# Altium project Peltier_ControllerV2.PrjPcb
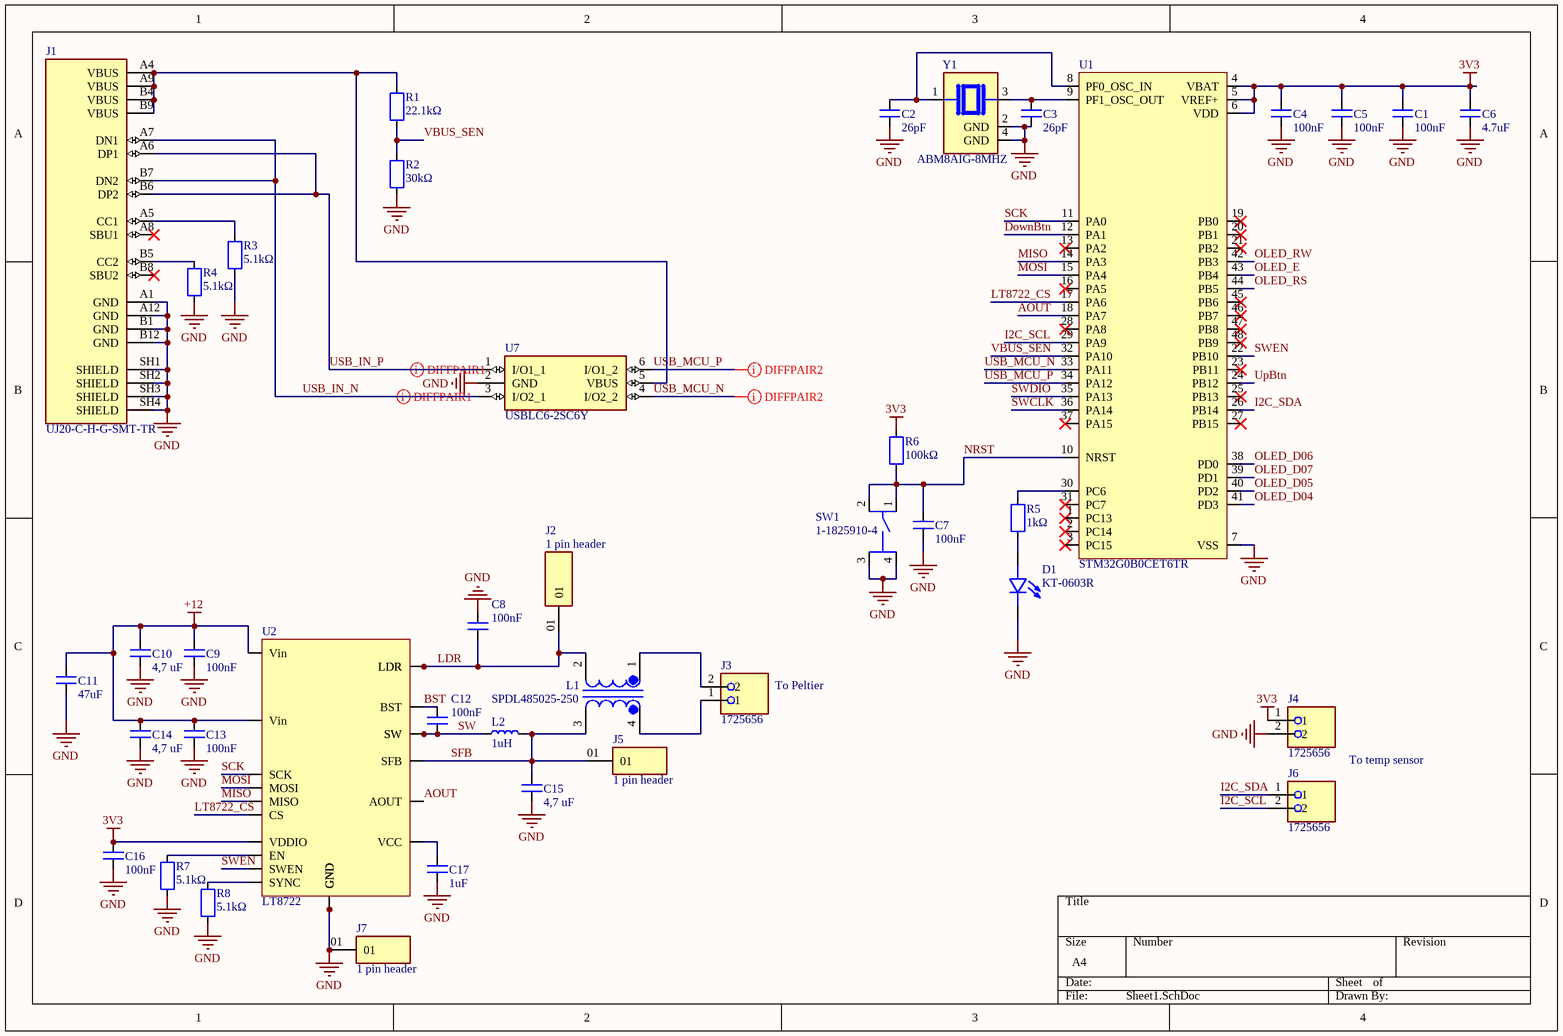
[diagram p0: Sheet1.SchDoc]
2 sheets, 76 parts. Net scope: global (net labels, ports and power ports of the same name join across sheets).
Board file: PCB1.PcbDoc
Sheets:
  Sheet1.SchDoc
  Sheet2.SchDoc

## Sheet Sheet1.SchDoc
size A4; SheetNumber: 1; SheetTotal: 2

### Parts
C1  100nF  [0603 Imperial]
C2  26pF  [0603 Imperial]
C3  26pF  [0603 Imperial]
C4  100nF  [0603 Imperial]
C5  100nF  [0603 Imperial]
C6  4.7uF  [0603 Imperial]
C7  100nF  [0603 Imperial]
C8  100nF  [0603 Imperial]
C9  100nF  [0603 Imperial]
C10  4,7 uF  [CAPC3216X180X55LL20T25]
C11  47uF  [FP-TAJD-MFG]
C12  100nF  [0603 Imperial]
C13  100nF  [0603 Imperial]
C14  4,7 uF  [CAPC3216X180X55LL20T25]
C15  4,7 uF  [CAPC3216X180X55LL20T25]
C16  100nF  [0603 Imperial]
C17  1uF  [0603 Imperial]
D1  KT-0603R  [LED_KT-0603R]
J1  UJ20-C-H-G-SMT-TR  [CUI_UJ20-C-H-G-SMT-TR]
J2  1 pin header  [SAMTEC_MTMM-101-X-X-S-X]
J3  1725656  [PHOENIX_1725656]
J4  1725656  [PHOENIX_1725656]
J5  1 pin header  [SAMTEC_MTMM-101-X-X-S-X]
J6  1725656  [PHOENIX_1725656]
J7  1 pin header  [SAMTEC_MTMM-101-X-X-S-X]
L1  SPDL485025-250  [IND_SPDL485025-250-2P-T]
L2  1uH  [1uH Power Inductor]
R1  22.1kΩ  [0603 Imperial]
R2  30kΩ  [0603 Imperial]
R3  5.1kΩ  [0603 Imperial]
R4  5.1kΩ  [0603 Imperial]
R5  1kΩ  [0603 Imperial]
R6  100kΩ  [0603 Imperial]
R7  5.1kΩ  [0603 Imperial]
R8  5.1kΩ  [0603 Imperial]
SW1  1-1825910-4  [TE_1-1825910-4]
U1  STM32G0B0CET6TR  [STM32G0B0CET6TR]
U2  LT8722  [LT8722]
U7  USBLC6-2SC6Y  [USB ESD protection]
Y1  ABM8AIG-8MHZ  [XTAL_ABM8AIG-8.000MHZ-8-V1R-T]

### Nets
3V3: C1.1 C4.1 C5.1 C6.1 C16.1 J4.1 R6.2 U1.4(VBAT) U1.5(VREF+) U1.6(VDD) U2.14(VDDIO)
+12: C9.1 C10.1 C11.2 C13.1 C14.1 U2.4(Vin) U2.11(Vin)
GND: C1.2 C2.2 C3.2 C4.2 C5.2 C6.2 C7.2 C8.1 C9.2 C10.2 C11.1 C13.2 C14.2 C15.2 C16.2 C17.2 D1.C J1.A1(GND) J1.A12(GND) J1.B1(GND) J1.B12(GND) J1.SH1(SHIELD) J1.SH2(SHIELD) J1.SH3(SHIELD) J1.SH4(SHIELD) J4.2 J7.01 R2.1 R3.1 R4.1 R7.1 R8.1 SW1.3 SW1.4 U1.7(VSS) U2.5(GND) U2.10(GND) U2.21(GND) U2.22(GND) U7.2(GND) Y1.2(GND) Y1.4(GND)
AOUT: U1.18(PA7) U2.20(AOUT)
BST: C12.1 U2.3(BST)
DownBtn: U1.12(PA1)
I2C_SCL: J6.2 U1.29(PA9)
I2C_SDA: J6.1 U1.26(PB14)
LDR: C8.2 J2.01 L1.2 U2.8(LDR) U2.9(LDR)
LT8722_CS: U1.17(PA6) U2.15(CS)
MISO: U1.14(PA3) U2.18(MISO)
MOSI: U1.15(PA4) U2.17(MOSI)
NRST: C7.1 R6.1 SW1.1 SW1.2 U1.10(NRST)
OLED_D04: U1.41(PD3)
OLED_D05: U1.40(PD2)
OLED_D06: U1.38(PD0)
OLED_D07: U1.39(PD1)
OLED_E: U1.43(PB4)
OLED_RS: U1.44(PB5)
OLED_RW: U1.42(PB3)
SCK: U1.11(PA0) U2.16(SCK)
SFB: C15.1 J5.01 L1.3 L2.2 U2.12(SFB)
SW: C12.2 L2.1 U2.6(SW) U2.7(SW)
SWCLK: U1.36(PA14)
SWDIO: U1.35(PA13)
SWEN: U1.22(PB10) U2.13(SWEN)
UpBtn: U1.24(PB12)
USB_IN_N: J1.A7(DN1) J1.B7(DN2) U7.3(I/O2_1)
USB_IN_P: J1.A6(DP1) J1.B6(DP2) U7.1(I/O1_1)
USB_MCU_N: U1.33(PA11) U7.4(I/O2_2)
USB_MCU_P: U1.34(PA12) U7.6(I/O1_2)
VBUS_SEN: R1.1 R2.2 U1.32(PA10)
NetC2_1: C2.1 U1.8(PF0_OSC_IN) Y1.1
NetC3_1: C3.1 U1.9(PF1_OSC_OUT) Y1.3
NetC17_1: C17.1 U2.2(VCC)
NetD1_A: D1.A R5.1
NetJ1_A4: J1.A4(VBUS) J1.A9(VBUS) J1.B4(VBUS) J1.B9(VBUS) R1.2 U7.5(VBUS)
NetJ1_A5: J1.A5(CC1) R3.2
NetJ1_B5: J1.B5(CC2) R4.2
NetJ3_1: J3.1 L1.4
NetJ3_2: J3.2 L1.1
NetR5_2: R5.2 U1.30(PC6)
NetR7_2: R7.2 U2.19(EN)
NetR8_2: R8.2 U2.1(SYNC)

Not connected (* = marked no-connect by the designer): J1 A8(SBU1)* B8(SBU2)*; U1 1(PC13)* 2(PC14)* 3(PC15)* 13(PA2)* 16(PA5)* 19(PB0)* 20(PB1)* 21(PB2)* 23(PB11)* 25(PB13)* 27(PB15)* 28(PA8)* 31(PC7)* 37(PA15)* 45(PB6)* 46(PB7)* 47(PB8)* 48(PB9)*

### Layout directives
differential pair: USB_IN_N, USB_IN_P, USB_MCU_N, USB_MCU_P

### Notes on the sheet
- (near J3) To Peltier
- To temp sensor
- Labels drawn without touching a wire or pin: \

### Library data of the parts
C1-C9 C12 C13 C16 C17 = 0603 C
C10 C14 C15 = 1206 Cap
C11 = Large Cap
D1 = KT-0603R: Red 0603 Light Emitting Diodes; MF: Hubei KENTO Elec; SnapEDA_Link: https://www.snapeda.com/parts/KT-0603R/Hubei+KENTO+Elec/view-part/?ref=snap; Package: Package; Value: *; MP: KT-0603R; Check_prices: https://www.snapeda.com/parts/KT-0603R/Hubei+KENTO+Elec/view-part/?ref=eda
J1 = UJ20-C-H-G-SMT-TR: Type C, USB 2.0, 480 Mbps, 20 Vdc, 5 A, Right Angle, Gold Flash, Surface Mount, Black Insulator, USB Receptacle; MF: Same Sky; SnapEDA_Link: https://www.snapeda.com/parts/UJ20-C-H-G-SMT-TR/Same+Sky/view-part/?ref=snap; Package: None; Value: *; MP: UJ20-C-H-G-SMT-TR; Check_prices: https://www.snapeda.com/parts/UJ20-C-H-G-SMT-TR/Same+Sky/view-part/?ref=eda
J2 J5 J7 = 1 pin header: Connector Header Through Hole 1 position; MF: Samtec; MP: MTMM-101-05-G-S-225; SnapEDA_Link: https://www.snapeda.com/parts/MTMM-101-05-G-S-225/Samtec/view-part/?ref=snap; Package: None; Value: *; Check_prices: https://www.snapeda.com/parts/MTMM-101-05-G-S-225/Samtec/view-part/?ref=eda
J3 J4 J6 = 1725656: PCB Terminal Screw 2.54mm 20AWG 160V 6A 2 Position COMBICON MPT Series | Phoenix Contact 1725656; SnapEDA_Link: https://www.snapeda.com/parts/1725656/Phoenix+Contact/view-part/?ref=snap; Package: None; Value: *; MF: Phoenix Contact; MP: 1725656; Check_prices: https://www.snapeda.com/parts/1725656/Phoenix+Contact/view-part/?ref=eda
L1 = SPDL485025-250-2P-T: Availability: Unavailable; Price: None; Value: *; MP: SPDL485025-250-2P-T; Package: None
L2 = 1uH Power Inductor
R1-R8 = 0603 R
SW1 = 1-1825910-4: Switch Tactile OFF _ON_ SPST Round Button PC Pins 0.05A 24VDC 100000Cycles 1.56N Thru-Hole; MF: TE Connectivity; Availability: Unavailable; SnapEDA_Link: https://www.snapeda.com/parts/1-1825910-4/TE%20Connectivity%20ALCOSWITCH%20Switches/view-part/558688/?ref=snap; Price: None; EU_RoHS_Compliance: Compliant; Package: None; TE_purchase_URL: https://www.te.com/usa-en/product-1-1825910-4.html?te_bu=Cor&te_type=disp&te_campaign=seda_glo_cor-seda-global-disp-prtnr-fy19-seda-model-bom-cta_sma-317_1&elqCampaignId=32493; MP: 1-1825910-4; Value: *
U7 = USB ESD protection: 17V Clamp 5A (8/20µs) Ipp Tvs Diode Surface Mount SOT-23-6; MF: STMicroelectronics; SnapEDA_Link: https://www.snapeda.com/parts/USBLC6-2SC6Y/STMicroelectronics/view-part/?ref=snap; Package: SOT-23-6 STMicroelectronics; Value: *; MP: USBLC6-2SC6Y; Check_prices: https://www.snapeda.com/parts/USBLC6-2SC6Y/STMicroelectronics/view-part/?ref=eda
Y1 = ABM8AIG-8.000MHZ-8-V1R-T: 8 MHz Â±10ppm Crystal 8pF 500 Ohms 4-SMD, No Lead; MF: Abracon LLC; Check_prices: https://www.snapeda.com/parts/ABM8AIG-8.000MHZ-8-V1R-T/Abracon+LLC/view-part/?ref=eda; Price: None; SnapEDA_Link: https://www.snapeda.com/parts/ABM8AIG-8.000MHZ-8-V1R-T/Abracon+LLC/view-part/?ref=snap; MP: ABM8AIG-8.000MHZ-8-V1R-T; Value: *; Availability: In Stock; Package: SMD-4 Abracon LLC; Purchase-URL: https://pricing.snapeda.com/search/part/ABM8AIG-8.000MHZ-8-V1R-T/?ref=eda

## Sheet Sheet2.SchDoc
size A4; SheetNumber: 2; SheetTotal: 2
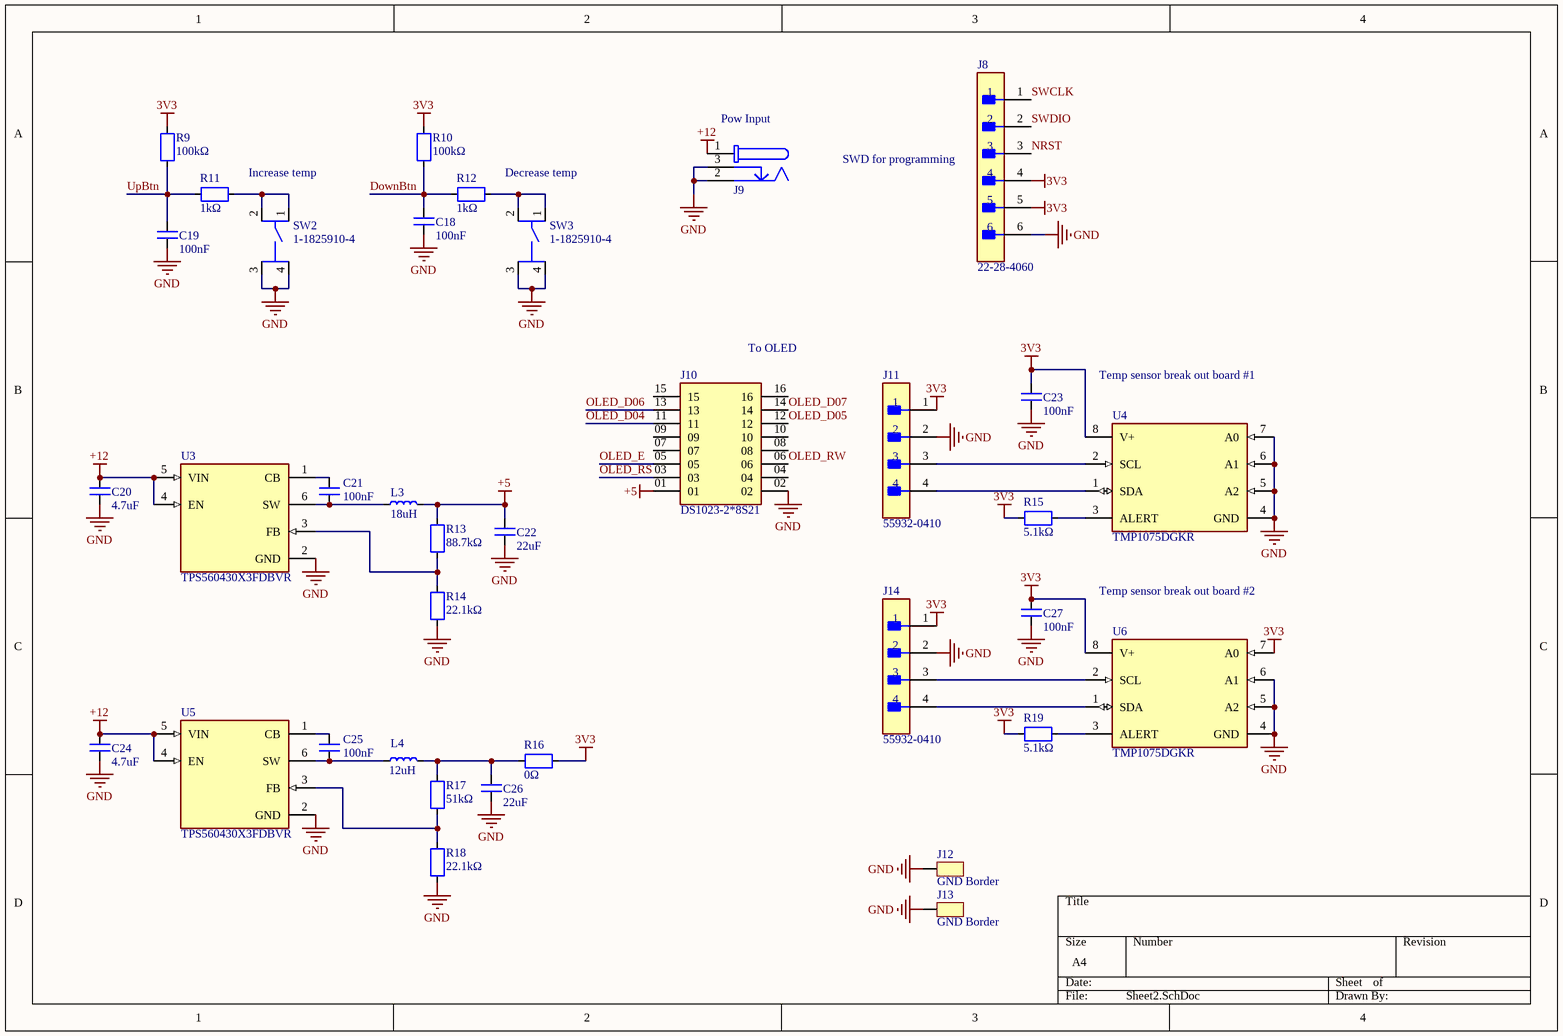
[diagram p1: Sheet2.SchDoc]

### Parts
C18  100nF  [0603 Imperial]
C19  100nF  [0603 Imperial]
C20  4.7uF  [0603 Imperial]
C21  100nF  [0603 Imperial]
C22  22uF  [0603 Imperial]
C23  100nF  [0603 Imperial]
C24  4.7uF  [0603 Imperial]
C25  100nF  [0603 Imperial]
C26  22uF  [0603 Imperial]
C27  100nF  [0603 Imperial]
J8  22-28-4060  [FP-22-28-4060-MFG]
J9  694106105102  [694108105102]  (value not drawn)
J10  DS1023-2*8S21  [16 pin header]
J11  55932-0410  [Wire Solder Pads]
J12  GND Border  [GND Border]
J13  GND Border  [GND Border]
J14  55932-0410  [Wire Solder Pads]
L3  18uH  [IND_SRR6038-180Y]
L4  12uH  [WE-PD2SR_7850]
R9  100kΩ  [0603 Imperial]
R10  100kΩ  [0603 Imperial]
R11  1kΩ  [0603 Imperial]
R12  1kΩ  [0603 Imperial]
R13  88.7kΩ  [0603 Imperial]
R14  22.1kΩ  [0603 Imperial]
R15  5.1kΩ  [0603 Imperial]
R16  0Ω  [0603 Imperial]
R17  51kΩ  [0603 Imperial]
R18  22.1kΩ  [0603 Imperial]
R19  5.1kΩ  [0603 Imperial]
SW2  1-1825910-4  [TE_1-1825910-4]
SW3  1-1825910-4  [TE_1-1825910-4]
U3  TPS560430X3FDBVR  [Buck]
U4  TMP1075DGKR  [FP-DGK0008A-IPC_A]
U5  TPS560430X3FDBVR  [Buck]
U6  TMP1075DGKR  [FP-DGK0008A-IPC_A]

### Nets
3V3: C23.2 C27.2 J8.4 J8.5 J11.1 J14.1 R9.2 R10.2 R15.2 R16.2 R19.2 U4.8(V+) U6.7(A0) U6.8(V+)
+5: C22.1 J10.01 L3.2 R13.2
+12: C20.1 C24.1 J9.1 U3.4(EN) U3.5(VIN) U5.4(EN) U5.5(VIN)
GND: C18.2 C19.2 C20.2 C22.2 C23.1 C24.2 C26.2 C27.1 J8.6 J9.2 J9.3 J10.02 J11.2 J12.0 J13.0 J14.2 R14.1 R18.1 SW2.3 SW2.4 SW3.3 SW3.4 U3.2(GND) U4.4(GND) U4.5(A2) U4.6(A1) U4.7(A0) U5.2(GND) U6.4(GND) U6.5(A2) U6.6(A1)
DownBtn: C18.1 R10.1 R12.2
NRST: J8.3
OLED_D04: J10.11
OLED_D05: J10.12
OLED_D06: J10.13
OLED_D07: J10.14
OLED_E: J10.05
OLED_RS: J10.03
OLED_RW: J10.06
SWCLK: J8.1
SWDIO: J8.2
UpBtn: C19.1 R9.1 R11.2
NetC21_1: C21.1 U3.1(CB)
NetC21_2: C21.2 L3.1 U3.6(SW)
NetC25_1: C25.1 U5.1(CB)
NetC25_2: C25.2 L4.1 U5.6(SW)
NetC26_1: C26.1 L4.2 R16.1 R17.2
NetJ11_3: J11.3 U4.2(SCL)
NetJ11_4: J11.4 U4.1(SDA)
NetJ14_3: J14.3 U6.2(SCL)
NetJ14_4: J14.4 U6.1(SDA)
NetR11_1: R11.1 SW2.1 SW2.2
NetR12_1: R12.1 SW3.1 SW3.2
NetR13_1: R13.1 R14.2 U3.3(FB)
NetR15_1: R15.1 U4.3(ALERT)
NetR17_1: R17.1 R18.2 U5.3(FB)
NetR19_1: R19.1 U6.3(ALERT)

Not connected (* = marked no-connect by the designer): J10 04 07 08 09 10 15 16

### Notes on the sheet
- Increase temp
- Decrease temp
- (near J9) Pow Input
- (near J8) SWD for programming
- (near J10) To OLED
- Temp sensor break out board #1
- Temp sensor break out board #2

### Library data of the parts
C18-C27 = 0603 C
J8 = 6 pin header: CONN HEADER VERT 6POS 2.54MM; Voltage Rating: 250V; Current Rating: 4A; Number of Contacts: 6; Max Voltage Rating (DC): 250.25kV; Gender: Male; Contact Resistance: 20mR; Connector Type: Male Pin; Color: Black; Max Voltage Rating (AC): 250V; Pitch: 2.54mm; Orientation: Straight; Max Operating Temperature: 75°C; Contact Plating: Tin; Depth: 2.49mm; Contact Type: Male Pin; Number of Positions: 6; Length: 15.24mm; Packaging: Bulk; Mount: Through Hole; Housing Material: Thermoplastic; Housing Color: Black; Termination: Solder; Contact Material: Brass; Min Operating Temperature: 0°C; Series: KK® 42375; Number of Rows: 1; Package Quantity: 1; RoHS Compliant: Yes; Contact Mating Length: 0.24inch
J9 = 694106105102: WR-DC DC Power Jack Connector, Male, Right Angled, 24V, 5A; Manufacturer: Wurth Elektronik; Opening Diameter: 6.4mm; Plug Inner Diameter: 2.05mm; Plug Outer Diameter: 5.5mm; ComponentLink1Description: Website Link; ComponentLink1URL: https://www.we-online.com/redexpert/article/694106105102?ad; ComponentLink2Description: Datasheet Link; ComponentLink2URL: https://www.we-online.com/redexpert/spec/694106105102?ad; Manufacturer Part Number: 694106105102; Category: DC Power Jack Connector; Match Code: WR-DC; Mount: Surface Mount; Operating Temperature Max: 85°C; Operating Temperature Min: -40°C; Packaging: Tape and Reel; Gender: Male; Orientation: Right Angled; Rated Current: 5A; Working Voltage: 24V
J10 = DS1023-2*8S21: SSQ - Samtec 2.54mm Square Tail Dual Row Socket Strip 8.5mm Profile - Fast Stock; MP: SSQ-108-XX-X-D; MF: Samtec; Package: None; Price: None; Value: *; Availability: Unavailable
J11 J14 = Wire Solder pads: CONN HEADER VERT 4POS 2MM; Number of Contacts: 4; Current Rating: 3A; Voltage Rating: 250V; Contact Plating: Tin; Series: 55932; Max Operating Temperature: 85°C; Contact Material: Brass; Case/Package: 0410; Min Operating Temperature: -25°C; Number of Positions: 4; Termination: Solder; Number of Circuits: 4; Orientation: Vertical; Pitch: 2mm; Radiation Hardening: No; Housing Material: Polyester; Number of Rows: 1; Contact Gender: Male; Packaging: Tray; RoHS Compliant: Yes; Mount: Through Hole
L3 = 18uH: Ind6.8x6.8x3.8mm,18uH30%1.5A,shdSMD | Bourns SRR6038-180Y; SnapEDA_Link: https://www.snapeda.com/parts/SRR6038-180Y/Bourns/view-part/?ref=snap; Package: NON STANDARD-2 Bourns; Value: *; MF: Bourns; MP: SRR6038-180Y; Check_prices: https://www.snapeda.com/parts/SRR6038-180Y/Bourns/view-part/?ref=eda
L4 = 12uH: WE-PD2SR SMT Power Inductor, size 7850, 1.2µH, 4.85A, 13mΩ; Manufacturer Part Number: 744787012; Manufacturer: Wurth Elektronik; Case/Size Code: 7850; DC Resistance: 8.5mΩ; Saturation Current: 6A; Self Resonant Frequency: 110MHz; Category: Shielded Power Inductors; Match Code: WE-PD2SR; ComponentLink1Description: Website Link; ComponentLink1URL: https://www.we-online.com/redexpert/article/744787012?ad; ComponentLink2Description: Datasheet Link; ComponentLink2URL: https://www.we-online.com/redexpert/spec/744787012?ad; Mount: Surface Mount; Operating Temperature Max: 125°C; Operating Temperature Min: -40°C; Packaging: Tape and Reel; Length: 7.8mm; Width: 7mm; Height: 5mm; DC Resistance Max: 13mΩ; Inductance: 1.2µH; Rated Current: 4.85A
R9-R19 = 0603 R
SW2 SW3 = 1-1825910-4: as SW1 on sheet Sheet1; Availability: Unavailable; SnapEDA_Link: https://www.snapeda.com/parts/1-1825910-4/TE%20Connectivity%20ALCOSWITCH%20Switches/view-part/558688/?ref=snap; Price: None; EU_RoHS_Compliance: Compliant; Package: None; TE_purchase_URL: https://www.te.com/usa-en/product-1-1825910-4.html?te_bu=Cor&te_type=disp&te_campaign=seda_glo_cor-seda-global-disp-prtnr-fy19-seda-model-bom-cta_sma-317_1&elqCampaignId=32493; MP: 1-1825910-4; Value: *
U3 U5 = Buck: MF: {'manufacturer': u'Texas Instruments'}; Package: None; Price: None; Value: *; MP: TPS560430X3FDBVR; Availability: Unavailable
U4 U6 = CMP-04948-000063-1: SENSOR TEMPERATURE; Interface: I2C; RoHS Compliant: Yes; Min Operating Temperature: -40°C; Max Operating Temperature: 125°C

## Nets that join several sheets
3V3: Sheet1 (11 pins), Sheet2 (14 pins)
+12: Sheet1 (7 pins), Sheet2 (7 pins)
GND: Sheet1 (42 pins), Sheet2 (31 pins)
DownBtn: Sheet1 (U1.12), Sheet2 (C18.1 R10.1 R12.2)
NRST: Sheet1 (5 pins), Sheet2 (J8.3)
OLED_D04: Sheet1 (U1.41), Sheet2 (J10.11)
OLED_D05: Sheet1 (U1.40), Sheet2 (J10.12)
OLED_D06: Sheet1 (U1.38), Sheet2 (J10.13)
OLED_D07: Sheet1 (U1.39), Sheet2 (J10.14)
OLED_E: Sheet1 (U1.43), Sheet2 (J10.05)
OLED_RS: Sheet1 (U1.44), Sheet2 (J10.03)
OLED_RW: Sheet1 (U1.42), Sheet2 (J10.06)
SWCLK: Sheet1 (U1.36), Sheet2 (J8.1)
SWDIO: Sheet1 (U1.35), Sheet2 (J8.2)
UpBtn: Sheet1 (U1.24), Sheet2 (C19.1 R9.1 R11.2)